# Altium schematic sheet Sheet2.SchDoc
size Letter
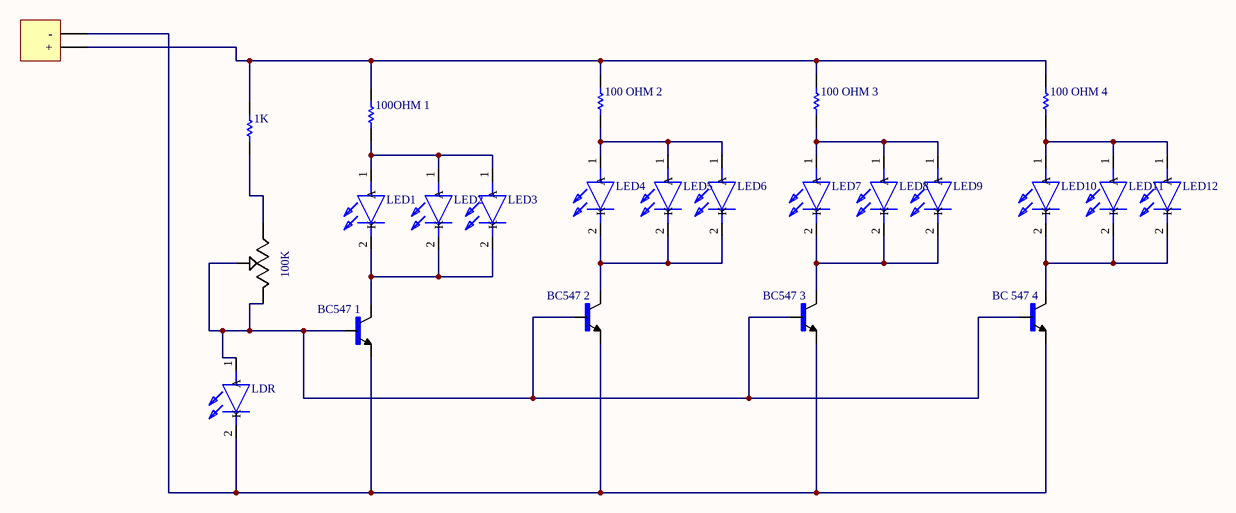
[diagram p0: Sheet2.SchDoc]

## Parts
1K  Res1  [AXIAL-0.3]  (value not drawn)
100_OHM_2  Res1  [AXIAL-0.3]  (value not drawn)
100_OHM_3  Res1  [AXIAL-0.3]  (value not drawn)
100_OHM_4  Res1  [AXIAL-0.3]  (value not drawn)
100K  (no value)  [*TRIM_EVN-D8AA03B14]
100OHM_1  Res1  [AXIAL-0.3]  (value not drawn)
BC547_1  BC547*  [*TO92]  (value not drawn)
BC547_2  BC547*  [*TO92]  (value not drawn)
BC547_3  BC547*  [*TO92]  (value not drawn)
BC_547_4  BC547*  [*TO92]  (value not drawn)
HEADER  Header 2  [HDR1X2]  (value not drawn)
LDR  L-53GD  [L-53GD]  (value not drawn)
LED1  L-53GD  [L-53GD]  (value not drawn)
LED2  L-53GD  [L-53GD]  (value not drawn)
LED3  L-53GD  [L-53GD]  (value not drawn)
LED4  L-53GD  [L-53GD]  (value not drawn)
LED5  L-53GD  [L-53GD]  (value not drawn)
LED6  L-53GD  [L-53GD]  (value not drawn)
LED7  L-53GD  [L-53GD]  (value not drawn)
LED8  L-53GD  [L-53GD]  (value not drawn)
LED9  L-53GD  [L-53GD]  (value not drawn)
LED10  L-53GD  [L-53GD]  (value not drawn)
LED11  L-53GD  [L-53GD]  (value not drawn)
LED12  L-53GD  [L-53GD]  (value not drawn)

## Nets
Net1K_1: 1K.1 100K.1
Net1K_2: 1K.2 100_OHM_2.2 100_OHM_3.2 100_OHM_4.2 100OHM_1.2 HEADER.1(+)
Net100_OHM_2_1: 100_OHM_2.1 LED4.1(A) LED5.1(A) LED6.1(A)
Net100_OHM_3_1: 100_OHM_3.1 LED7.1(A) LED8.1(A) LED9.1(A)
Net100_OHM_4_1: 100_OHM_4.1 LED10.1(A) LED11.1(A) LED12.1(A)
Net100K_2: 100K.2 100K.3 BC547_1.2(B) BC547_2.2(B) BC547_3.2(B) BC_547_4.2(B) LDR.1(A)
Net100OHM_1_1: 100OHM_1.1 LED1.1(A) LED2.1(A) LED3.1(A)
NetBC547_1_1: BC547_1.1(C) LED1.2(K) LED2.2(K) LED3.2(K)
NetBC547_1_3: BC547_1.3(E) BC547_2.3(E) BC547_3.3(E) BC_547_4.3(E) HEADER.2(-) LDR.2(K)
NetBC547_2_1: BC547_2.1(C) LED4.2(K) LED5.2(K) LED6.2(K)
NetBC547_3_1: BC547_3.1(C) LED7.2(K) LED8.2(K) LED9.2(K)
NetBC_547_4_1: BC_547_4.1(C) LED10.2(K) LED11.2(K) LED12.2(K)

## Library data of the parts
1K 100_OHM_2-100_OHM_4 100OHM_1 = Res1: Resistor; Value: 1K; Published: 8-Jun-2000; LatestRevisionDate: 17-Jul-2002; LatestRevisionNote: Re-released for DXP Platform.; PackageReference: AXIAL-0.3; Publisher: Altium Limited; PackageDescription: Axial Device, Thru-Hole; 2 Leads; 0.3 in Pin Spacing
100K = EVN-D8AA03B14: Trimmer; Carbon; Rest 10 Kilohms; PCB; 1 Turn; Pwr-Rtg 0.1 W; Linear; Top Adj; 6 mm SQ; MF: Panasonic Electronic; Availability: Unavailable; Price: None; SnapEDA_Link: https://www.snapeda.com/parts/EVN-D8AA03B14/Panasonic%20Electronic%20Components/view-part/?ref=snap; MP: EVN-D8AA03B14; Package: PQFP-44 Panasonic; Value: *
BC547_1-BC547_3 BC_547_4 = BC547*: Transistor NPN BC547 PHILIPS miliampere=100 TO92; MF: ON Semiconductor; MP: BC547; Price: None; Package: TO-92 ON Semiconductor; Availability: Unavailable; SnapEDA_Link: https://www.snapeda.com/parts/BC547/ON%20Semiconductor/view-part/?ref=snap; Value: *
HEADER = Header 2: Header, 2-Pin; LatestRevisionDate: 17-Jul-2002; LatestRevisionNote: Re-released for DXP Platform.; Publisher: Altium Limited
LDR LED1-LED12 = L-53GD: LED; Manufacturer_Name: Kingbright; Allied_Number: 70424261; Datasheet Link: http://docs-emea.rs-online.com/webdocs/151e/0900766b8151e408.pdf; Manufacturer_Part_Number: L-53GD; Mouser Part Number: N/A; Mouser Price/Stock: https://www.mouser.com/Search/Refine.aspx?Keyword=N%2FA; RS Part Number: 2286004A; RS Price/Stock: http://uk.rs-online.com/web/p/products/2286004A; Allied Price/Stock: http://www.alliedelec.com/kingbright-l-53gd/70424261/